# EAGLE design viraj-hello-ftdi-44 (EAGLE 7.6.0)
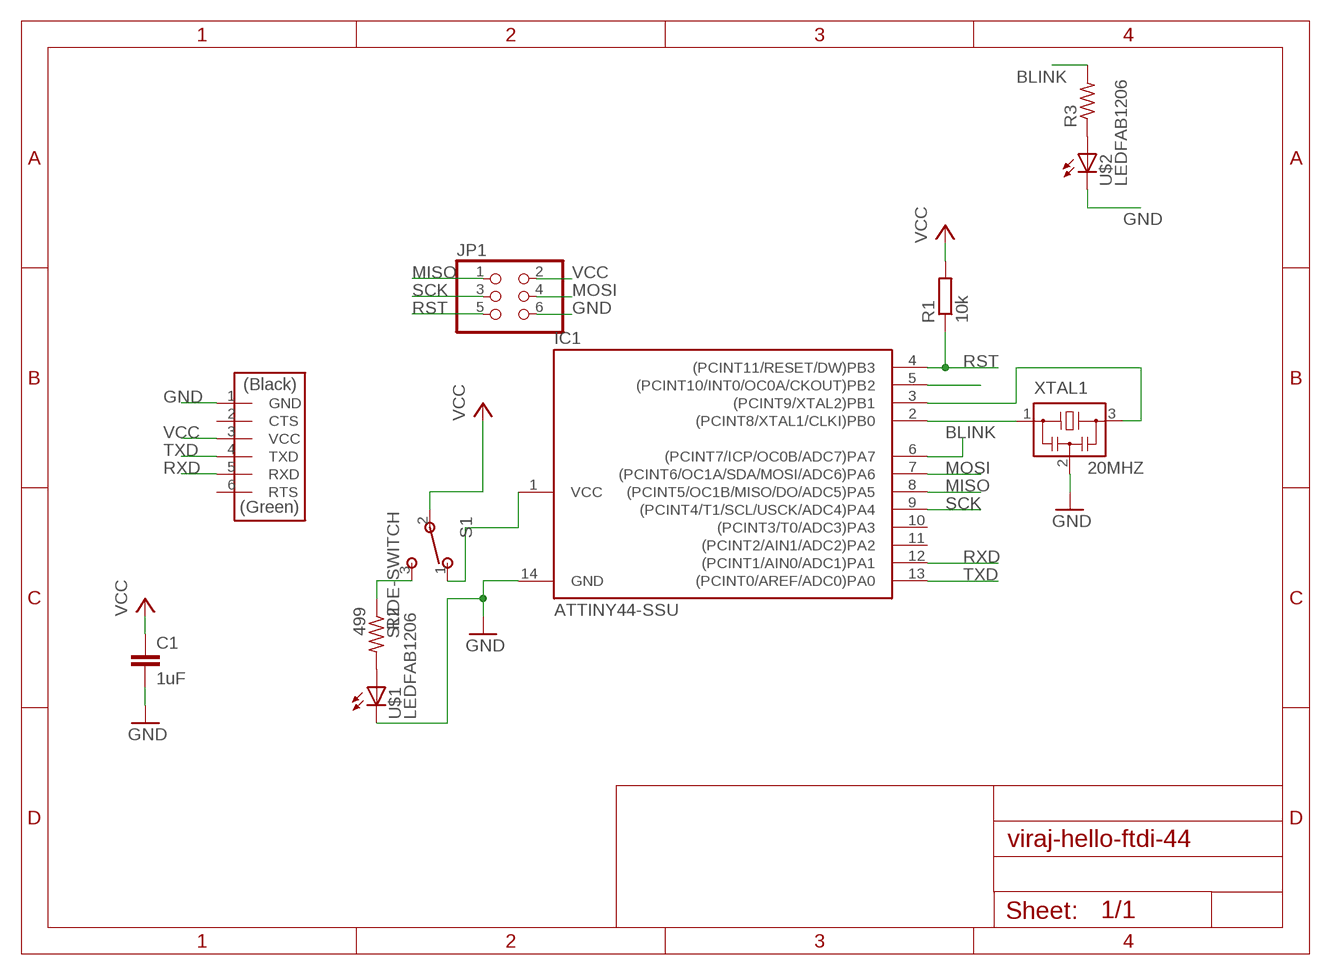
[diagram p0: schematic, sheet 1]

## Parts
C1  1uF  C-EUC1206  [C1206]
IC1  ATTINY44-SSU  [SOIC14]
J2  FTDI-SMD-HEADER  [1X06SMD]
JP1  PINHD-2X3-SMD  [2X03SMD]
R1  10k  R-EU_M1206  [M1206]
R2  499  RES-US1206FAB  [R1206FAB]
R3  RES-US1206FAB  [R1206FAB]
S1  SLIDE-SWITCH  [AYZ0102AGRLC]
U$1  LEDFAB1206  [LED1206FAB]
U$2  LEDFAB1206  [LED1206FAB]
XTAL1  20MHZ  RESONATOR  [EFOBM]

## Nets
BLINK: IC1.6((PCINT7/ICP/OC0B/ADC7)PA7) R3.2
GND: C1.2 IC1.14(GND) J2.1(GND) JP1.6 U$1.2(C) U$2.2(C) XTAL1.2
MISO: IC1.8((PCINT5/OC1B/MISO/DO/ADC5)PA5) JP1.1
MOSI: IC1.7((PCINT6/OC1A/SDA/MOSI/ADC6)PA6) JP1.4
N$1: IC1.1(VCC) S1.1
N$2: R2.1 S1.3
N$3: R2.2 U$1.1(A)
N$4: IC1.5((PCINT10/INT0/OC0A/CKOUT)PB2)
N$5: R3.1 U$2.1(A)
N$7: IC1.2((PCINT8/XTAL1/CLKI)PB0) XTAL1.1
N$8: IC1.3((PCINT9/XTAL2)PB1) XTAL1.3
RST: IC1.4((PCINT11/RESET/DW)PB3) JP1.5 R1.1
RXD: IC1.12((PCINT1/AIN0/ADC1)PA1) J2.5(RXD)
SCK: IC1.9((PCINT4/T1/SCL/USCK/ADC4)PA4) JP1.3
TXD: IC1.13((PCINT0/AREF/ADC0)PA0) J2.4(TXD)
VCC: C1.1 J2.3(VCC) JP1.2 R1.2 S1.2
Unconnected: IC1.10((PCINT3/T0/ADC3)PA3) IC1.11((PCINT2/AIN1/ADC2)PA2) J2.2(CTS) J2.6(RTS)

## Library data of the parts
C1 = rcl:C-EU: CAPACITOR, European symbol
IC1 = fab:ATTINY44
J2 = fab:FTDI-SMD-HEADER
JP1 = fab:PINHD-2X3-SMD: PIN HEADER
R1 = rcl:R-EU_: RESISTOR, European symbol
R2 R3 = fab:RES-US: Resistor (US Symbol) Variants with postfix FAB are widened to allow the routing of internal traces
S1 = fab:SLIDE-SWITCH: SMD slide-switch AYZ0102AGRLC as found in the fablab inventory. Includes the mounting holes. Made by Zaerc.
U$1 U$2 = fab:LED: LED
XTAL1 = fab:RESONATOR

## Net classes
0 viraj: width 0.4 mm, clearance 0.04 mm

## Board
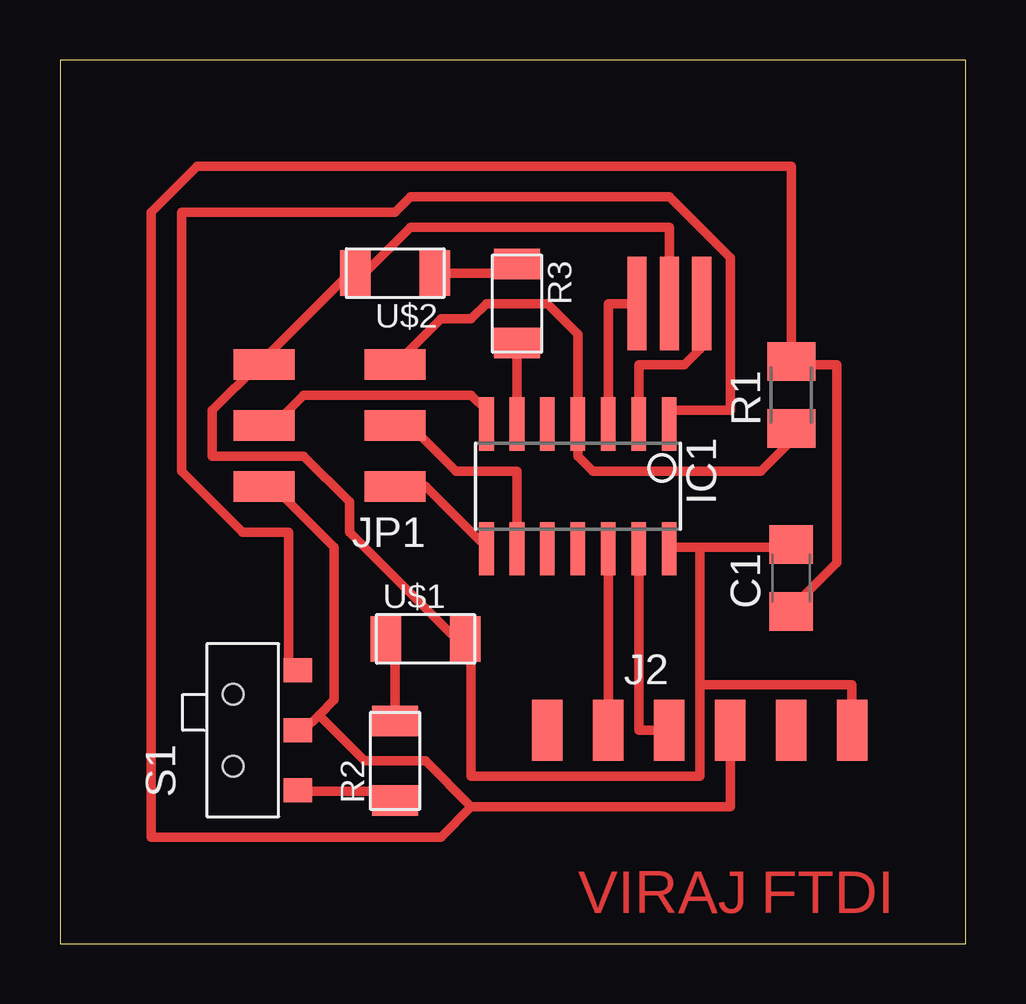
[diagram p1: board, top side]

Size 37.77 x 36.82 mm. Coordinates in mm from the lower left corner, seen from the top.
Outline: 0,0 37.77,0 37.77,36.82 0,36.82 0,0
Copper layers (1*16): Top 0.035mm / dielectric 1.5mm / Bottom 0.035mm
Design rules "fab": minimum track width 0.3mm, minimum drill 32mil, track to track 0.315mm, track to pad 0.315mm, pad to pad 0.315mm, via to via 0.315mm, smd to smd 0.315mm, copper to edge 40mil, drill to drill 16mil, minimum pad ring 10mil, minimum via ring 8mil, stop-mask expansion 4mil, vias tented up to drill 0mil, thermal gap 10mil

### Footprints (pad centres in the part's own frame; a part is rotated, then mirrored left to right if it is on the bottom)
C1206 = smd 1.6 x 1.8: 1 -1.4,0; 2 1.4,0
SOIC14 = smd 0.61 x 2.21: 1 -3.81,-2.603; 2 -2.54,-2.603; 3 -1.27,-2.603; 4 0,-2.603; 5 1.27,-2.603; 6 2.54,-2.603; 7 3.81,-2.603; 8 3.81,2.603; 9 2.54,2.603; 10 1.27,2.603; 11 0,2.603; 12 -1.27,2.603; 13 -2.54,2.603; 14 -3.81,2.603
1X06SMD = smd 2.54 x 1.27: 1 0,6.35; 2 0,3.81; 3 0,1.27; 4 0,-1.27; 5 0,-3.81; 6 0,-6.35
2X03SMD = smd 2.54 x 1.27: 1 -2.54,2.54; 2 2.92,2.54; 3 -2.54,0; 4 2.92,0; 5 -2.54,-2.54; 6 2.92,-2.54
M1206 = smd 1.6 x 2: 1 -1.4,0; 2 1.4,0
R1206FAB = smd 1.27 x 1.905: 1 -1.651,0; 2 1.651,0
AYZ0102AGRLC = smd 1 x 1.2: 1 2.5,-2.3; 2 0,-2.3; 3 -2.5,-2.3 | hole 0.85: -1.5,0.4; 1.5,0.4
LED1206FAB = smd 1.27 x 1.905: 1 -1.651,0; 2 1.651,0
EFOBM = smd 0.8 x 3.9: 1 -1.35,0; 2 0,0; 3 1.35,0

### Placement (x,y rotation side)
C1  30.48,15.24 90 top
IC1  21.59,19.05 180 top
J2  26.67,8.89 270 top
JP1  11.43,21.59 180 top
R1  30.48,22.86 90 top
R2  13.97,7.62 90 top
R3  19.05,26.67 270 top
S1  7.62,8.89 90 top
U$1  15.24,12.7 0 top
U$2  13.97,27.94 180 top
XTAL1  25.4,26.67 180 top

### Tracks (layer width: path | path; a pad name or v marks a point on that pad's centre or on a via)
BLINK
  Top 0.4: IC1.6 R3.2
GND
  Top 0.4: 8.26,24.13 12.07,27.94 U$2.2 12.7,27.94 14.61,29.84 25.4,29.84 XTAL1.2 | 26.67,16.51 25.4,16.51 IC1.14 | 26.67,16.51 30.48,16.51 C1.2 | 26.67,16.51 26.67,10.79 | 26.67,10.79 26.67,6.99 17.14,6.99 17.14,12.7 U$1.2 16.51,12.7 12.07,17.15 12.07,18.41 10.16,20.32 6.35,20.32 6.35,22.23 8.26,24.13 | J2.1 33.02,10.79 26.67,10.79 | 8.26,24.13 JP1.6
MISO
  Top 0.4: JP1.1 15.24,19.05 17.78,16.51 IC1.8
MOSI
  Top 0.4: IC1.7 17.78,22.23 17.14,22.86 10.16,22.86 8.89,21.59 JP1.4
N$1
  Top 0.4: S1.1 9.53,11.43 9.53,17.15 7.62,17.15 5.08,19.69 5.08,30.48 13.97,30.48 14.61,31.12 25.4,31.12 27.94,28.57 27.94,22.23 25.4,22.23 IC1.1
N$2
  Top 0.4: S1.3 10.16,6.35 13.97,6.35 R2.1
N$3
  Top 0.4: R2.2 13.97,12.7 U$1.1
N$5
  Top 0.4: U$2.1 19.05,27.94 R3.1
N$7
  Top 0.4: IC1.2 24.13,24.13 26.04,24.13 26.67,24.77 26.67,26.67 XTAL1.1
N$8
  Top 0.4: IC1.3 22.86,26.67 XTAL1.3 24.13,26.67
RST
  Top 0.4: R1.1 30.48,20.95 29.21,19.69 22.23,19.69 21.59,20.32 IC1.4 21.59,25.4 20.32,26.67 17.78,26.67 17.14,26.03 15.88,26.03 JP1.5
RXD
  Top 0.4: J2.5 IC1.12
SCK
  Top 0.4: IC1.9 19.05,19.69 16.51,19.69 14.61,21.59 JP1.3
TXD
  Top 0.4: IC1.13 24.13,8.89 J2.4
VCC
  Top 0.4: C1.1 30.48,13.97 32.38,15.88 32.38,24.13 30.48,24.13 R1.2 30.48,32.38 5.71,32.38 3.81,30.48 3.81,4.45 15.88,4.45 17.14,5.71 | 10.79,9.53 11.43,10.16 11.43,16.51 8.89,19.05 JP1.2 | 10.79,9.53 10.16,8.89 S1.2 | J2.3 27.94,5.71 17.14,5.71 | 17.14,5.71 15.24,7.62 12.7,7.62 10.79,9.53

### Text on the board
Top: VIRAJ | FTDI